# Altium schematic sheet power_POS3V3.schdoc: POS3P3V.schdoc
size A4; Organization: Badgerloop; Address1: 133 Engineering Research; Address2: Building; Address3: Madison, WI 53715; DocumentNumber: 1; Revision: A; SheetNumber: 1; SheetTotal: 2
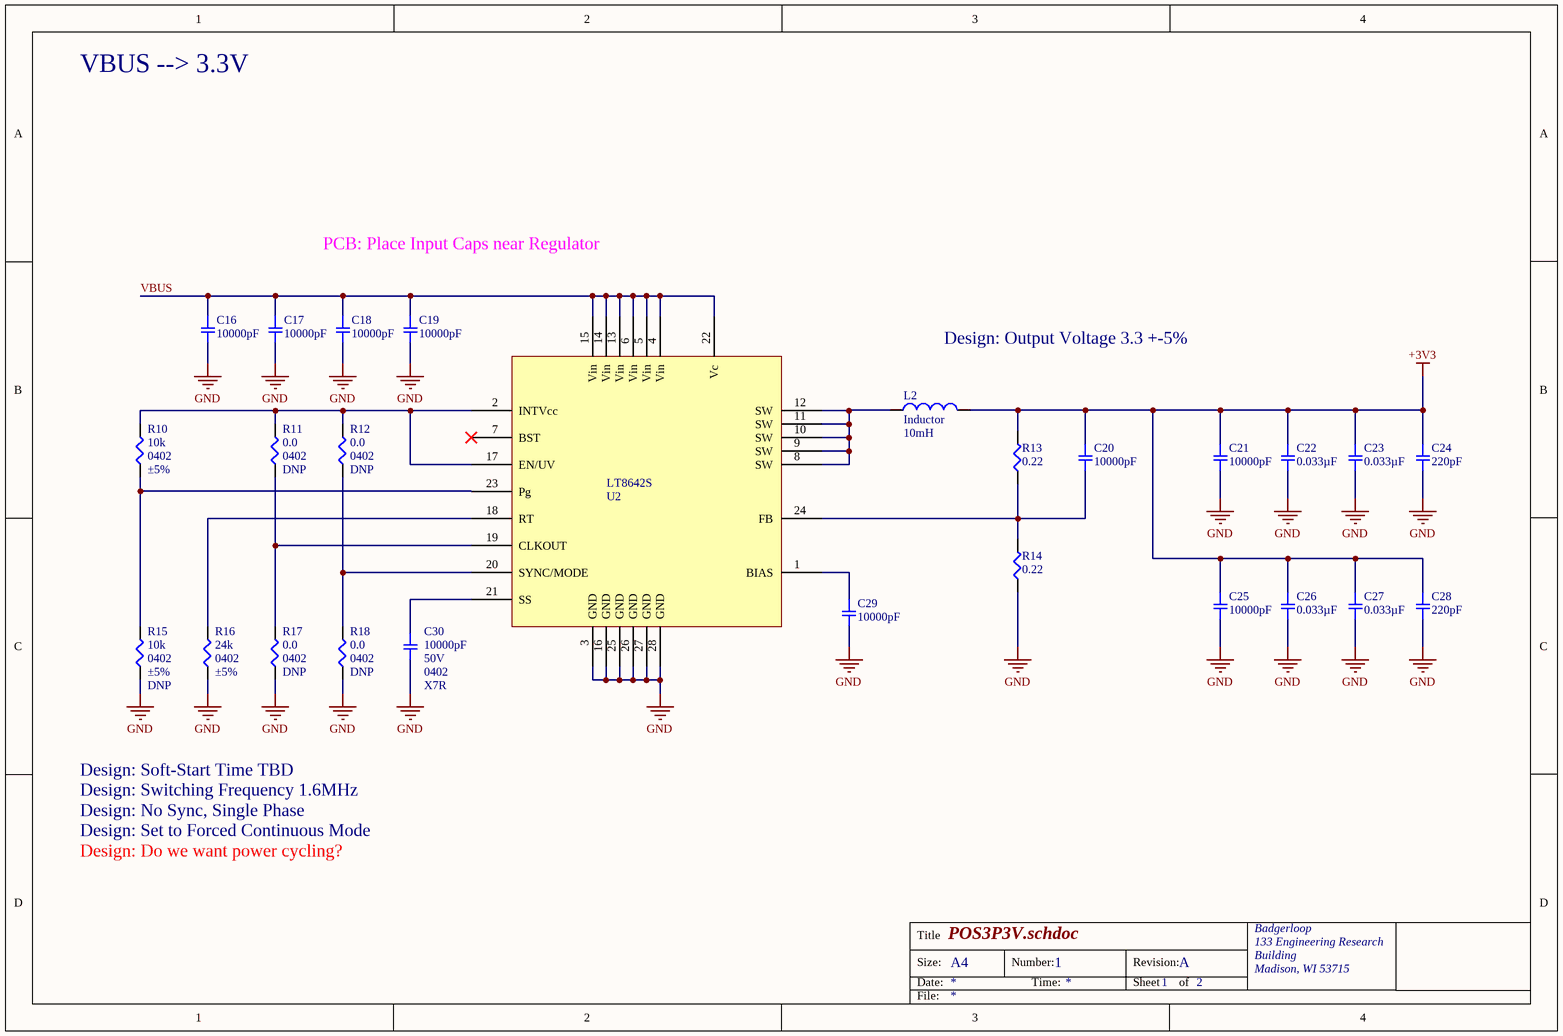
[diagram p0: power_POS3V3.schdoc]

## Parts
C16  10000pF  [SMD-0805C]
C17  10000pF  [SMD-0805C]
C18  10000pF  [SMD-0805C]
C19  10000pF  [SMD-0805C]
C20  10000pF  [SMD-0805C]
C21  10000pF  [SMD-0805C]
C22  0.033µF  [SMD-1206C]
C23  0.033µF  [SMD-1206C]
C24  220pF  [SMD-0402C]
C25  10000pF  [SMD-0805C]
C26  0.033µF  [SMD-1206C]
C27  0.033µF  [SMD-1206C]
C28  220pF  [SMD-0402C]
C29  10000pF  [SMD-0805C]
C30  10000pF  Voltage: 50V  Temperature Coefficient: X7R  Package / Case: 0402  [SMD-0402C]
L2  Inductor  value 10mH  [0402-A]
R10  10k  Tolerance: ±5%  Supplier Device Package: 0402  [SMD-0402-RES]
R11  0.0  Supplier Device Package: 0402  BOM: DNP  [SMD-0402-RES]
R12  0.0  Supplier Device Package: 0402  BOM: DNP  [SMD-0402-RES]
R13  0.22  [SMD-0402-RES]
R14  0.22  [SMD-0402-RES]
R15  10k  Tolerance: ±5%  Supplier Device Package: 0402  BOM_CONFIG: DNP  [SMD-0402-RES]
R16  24k  Tolerance: ±5%  Supplier Device Package: 0402  [SMD-0402-RES]
R17  0.0  Supplier Device Package: 0402  BOM: DNP  [SMD-0402-RES]
R18  0.0  Supplier Device Package: 0402  BOM: DNP  [SMD-0402-RES]
U2  LT8642S

## Nets
+3V3: C20.1 C21.1 C22.1 C23.1 C24.1 C25.1 C26.1 C27.1 C28.1 L2.2 R13.2
GND: C16.2 C17.2 C18.2 C19.2 C21.2 C22.2 C23.2 C24.2 C25.2 C26.2 C27.2 C28.2 C29.2 C30.2 R14.1 R15.1 R16.1 R17.1 R18.1 U2.3(GND) U2.16(GND) U2.25(GND) U2.26(GND) U2.27(GND) U2.28(GND)
VBUS: C16.1 C17.1 C18.1 C19.1 U2.4(Vin) U2.5(Vin) U2.6(Vin) U2.13(Vin) U2.14(Vin) U2.15(Vin) U2.22(Vc)
NetC20_2: C20.2 R13.1 R14.2 U2.24(FB)
NetC29_1: C29.1 U2.1(BIAS)
NetC30_1: C30.1 U2.21(SS)
NetL2_1: L2.1 U2.8(SW) U2.9(SW) U2.10(SW) U2.11(SW) U2.12(SW)
NetR10_1: R10.1 R15.2 U2.23(Pg)
NetR10_2: R10.2 R11.2 R12.2 U2.2(INTVcc) U2.17(EN/UV)
NetR11_1: R11.1 R17.2 U2.19(CLKOUT)
NetR12_1: R12.1 R18.2 U2.20(SYNC/MODE)
NetR16_2: R16.2 U2.18(RT)

Not connected (* = marked no-connect by the designer): U2 7(BST)*

## Notes on the sheet
- VBUS --> 3.3V
- PCB: Place Input Caps near Regulator
- Design: Output Voltage 3.3 +-5%
- Design: Soft-Start Time TBD
- Design: Switching Frequency 1.6MHz
- Design: No Sync, Single Phase
- Design: Set to Forced Continuous Mode
- Design: Do we want power cycling?
- Title
- Size:
- Date:
- A4
- Number:
- Time:
- Revision:
- Sheet
- of
- File:

## Library data of the parts
C16-C21 C25 C29 = GC321AD72E103KX01D: CAP CER 10000PF 250V X7T 0805; Manufacturer: Murata Electronics North America; Factory Stock: 0; Unit Price (USD): 0.3; Minimum Quantity: 1; Tolerance: ±10%; Datasheets: http://search.murata.co.jp/Ceramy/image/img/A01X/G101/ENG/GC321AD72E103KX01-01.pdf; Image: //media.digikey.com/Renders/Murata%20Renders/0805(GC3)200x125.jpg; Digi-Key Part Number: 490-13986-1-ND; Part Number: GC321AD72E103KX01D; Quantity Available: 4000; @ qty: 0; Packaging: Cut Tape (CT); Series: GC3; Part Status: Active; Value: 10000pF; Voltage: 250V; Temperature Coefficient: X7T; Operating Temperature: -55°C ~ 125°C; Features: -; Ratings: AEC-Q200; Applications: Automotive; Mounting Type: Surface Mount, MLCC; Package / Case: 0805 (2012 Metric); Size / Dimension: 0.079" L x 0.049" W (2.00mm x 1.25mm); Height - Seated (Max): -; Thickness (Max): 0.039" (1.00mm); Lead Spacing: -; Lead Style: -
C22 C23 C26 C27 = GC331AD72E333KX01D: CAP CER 0.033UF 250V X7T 1206; Manufacturer: Murata Electronics North America; Factory Stock: 0; Unit Price (USD): 0.33; Minimum Quantity: 1; Tolerance: ±10%; Datasheets: http://search.murata.co.jp/Ceramy/image/img/A01X/G101/ENG/GC331AD72E333KX01-01.pdf; Image: //media.digikey.com/Renders/Murata%20Renders/1206(GC3)320x160.jpg; Digi-Key Part Number: 490-13989-1-ND; Part Number: GC331AD72E333KX01D; Quantity Available: 3999; @ qty: 0; Packaging: Cut Tape (CT); Series: GC3; Part Status: Active; Value: 0.033µF; Voltage: 250V; Temperature Coefficient: X7T; Operating Temperature: -55°C ~ 125°C; Features: -; Ratings: AEC-Q200; Applications: Automotive; Mounting Type: Surface Mount, MLCC; Package / Case: 1206 (3216 Metric); Size / Dimension: 0.126" L x 0.063" W (3.20mm x 1.60mm); Height - Seated (Max): -; Thickness (Max): 0.039" (1.00mm); Lead Spacing: -; Lead Style: -
C24 C28 = GCM1555C1H221JA16D: CAP CER 220PF 50V NP0 0402; Manufacturer: Murata Electronics North America; Factory Stock: 0; Unit Price (USD): 0.1; Minimum Quantity: 1; Tolerance: ±5%; Temperature Coefficient: C0G, NP0; Datasheets: http://www.murata.com/~/media/webrenewal/support/library/catalog/products/capacitor/mlcc/c03e.ashx; Image: //media.digikey.com/Renders/Murata%20Renders/ZRB-SERIES-0402.jpg; Digi-Key Part Number: 490-4927-1-ND; Part Number: GCM1555C1H221JA16D; Quantity Available: 20733; @ qty: 0; Packaging: Cut Tape (CT); Series: GCM; Part Status: Active; Value: 220pF; Voltage: 50V; Operating Temperature: -55°C ~ 125°C; Features: -; Ratings: AEC-Q200; Applications: Automotive; Mounting Type: Surface Mount, MLCC; Package / Case: 0402 (1005 Metric); Size / Dimension: 0.039" L x 0.020" W (1.00mm x 0.50mm); Height - Seated (Max): -; Thickness (Max): 0.022" (0.55mm); Lead Spacing: -; Lead Style: -
C30 = GCM155R71H103KA55D: CAP CER 10000PF 50V X7R 0402; Manufacturer: Murata Electronics North America; Factory Stock: 0; Unit Price (USD): 0.1; Minimum Quantity: 1; Datasheets: http://www.murata.com/~/media/webrenewal/support/library/catalog/products/capacitor/mlcc/c03e.ashx; Image: //media.digikey.com/Renders/Murata%20Renders/ZRB-SERIES-0402.jpg; Digi-Key Part Number: 490-4762-1-ND; Part Number: GCM155R71H103KA55D; Quantity Available: 650067; @ qty: 0; Packaging: Cut Tape (CT); Series: GCM; Part Status: Active; Value: 10000pF; Operating Temperature: -55°C ~ 125°C; Features: -; Ratings: AEC-Q200; Applications: Automotive; Mounting Type: Surface Mount, MLCC; Size / Dimension: 0.039" L x 0.020" W (1.00mm x 0.50mm); Height - Seated (Max): -; Thickness (Max): 0.022" (0.55mm); Lead Spacing: -; Lead Style: -
L2 = Inductor: Code_IEC: 1005; Published: 8-Jun-2000; LatestRevisionDate: 29-May-2009; LatestRevisionNote: IPC-7351 Footprint Added.; PackageReference: 0402-A; Publisher: Altium Limited; PackageDescription: Chip Inductor; Code_JEITA: 0402
R10 R15 = ERJ-2GEJ103X: RES SMD 10K OHM 5% 1/10W 0402; Manufacturer: Panasonic Electronic Components; Factory Stock: 0; Unit Price (USD): 0.00350; @ qty: 1500; Minimum Quantity: 1; Power (Watts): 0.1W, 1/10W; Temperature Coefficient: ±200ppm/°C; Part Number: ERJ-2GEJ103X; Datasheets: http://industrial.panasonic.com/www-cgi/jvcr13pz.cgi?E+PZ+3+AOA0001+ERJ2GEJ103X+7+WW; Image: //media.digikey.com/Photos/Panasonic%20Photos/ERJ-PA2-Series.jpg; Digi-Key Part Number: P10KJCT-ND; Quantity Available: 2560215; Packaging: Cut Tape (CT); Series: ERJ; Part Status: Active; Value: 10k; Composition: Thick Film; Features: Automotive AEC-Q200; Operating Temperature: -55°C ~ 155°C; Package / Case: 0402 (1005 Metric); Size / Dimension: 0.039" L x 0.020" W (1.00mm x 0.50mm); Height - Seated (Max): 0.016" (0.40mm); Number of Terminations: 2; Failure Rate: -
R11 R12 R17 R18 = ERJ-2GE0R00X: RES SMD 0.0OHM JUMPER 1/10W 0402; Manufacturer: Panasonic Electronic Components; Factory Stock: 0; Unit Price (USD): 0.00384; @ qty: 1500; Minimum Quantity: 1; Power (Watts): 0.1W, 1/10W; Part Number: ERJ-2GE0R00X; Datasheets: http://industrial.panasonic.com/www-cgi/jvcr13pz.cgi?E+PZ+3+AOA0001+ERJ2GE0R00X+7+WW; Image: //media.digikey.com/Photos/Panasonic%20Photos/ERJ-PA2-Series.jpg; Digi-Key Part Number: P0.0JCT-ND; Quantity Available: 3152483; Packaging: Cut Tape (CT); Series: ERJ; Part Status: Active; Value: 0.0; Tolerance: Jumper; Composition: Thick Film; Features: Automotive AEC-Q200; Temperature Coefficient: -; Operating Temperature: -55°C ~ 155°C; Package / Case: 0402 (1005 Metric); Size / Dimension: 0.039" L x 0.020" W (1.00mm x 0.50mm); Height - Seated (Max): 0.016" (0.40mm); Number of Terminations: 2; Failure Rate: -
R13 R14 = ERJ-2BQFR22X: RES SMD 0.22 OHM 1% 1/6W 0402; Manufacturer: Panasonic Electronic Components; Factory Stock: 0; Unit Price (USD): 0.10080; @ qty: 1500; Minimum Quantity: 1; Power (Watts): 0.167W, 1/6W; Temperature Coefficient: ±250ppm/°C; Part Number: ERJ-2BQFR22X; Datasheets: https://industrial.panasonic.com/cdbs/www-data/pdf/RDA0000/AOA0000C239.pdf; Image: //media.digikey.com/Photos/Panasonic%20Photos/ERJ-PA2-Series.jpg; Digi-Key Part Number: P.22AKCT-ND; Quantity Available: 14922; Packaging: Cut Tape (CT); Series: ERJ; Part Status: Active; Value: 0.22; Tolerance: ±1%; Composition: Thick Film; Features: Automotive AEC-Q200, Current Sense; Operating Temperature: -55°C ~ 125°C; Package / Case: 0402 (1005 Metric); Supplier Device Package: 0402; Size / Dimension: 0.039" L x 0.020" W (1.00mm x 0.50mm); Height - Seated (Max): 0.016" (0.40mm); Number of Terminations: 2; Failure Rate: -
R16 = ERJ-2GEJ243X: RES SMD 24K OHM 5% 1/10W 0402; Manufacturer: Panasonic Electronic Components; Factory Stock: 0; Unit Price (USD): 0.00350; @ qty: 1500; Minimum Quantity: 1; Power (Watts): 0.1W, 1/10W; Temperature Coefficient: ±200ppm/°C; Part Number: ERJ-2GEJ243X; Datasheets: http://industrial.panasonic.com/www-cgi/jvcr13pz.cgi?E+PZ+3+AOA0001+ERJ2GEJ243X+7+WW; Image: //media.digikey.com/Photos/Panasonic%20Photos/ERJ-PA2-Series.jpg; Digi-Key Part Number: P24KJCT-ND; Quantity Available: 21017; Packaging: Cut Tape (CT); Series: ERJ; Part Status: Active; Value: 24k; Composition: Thick Film; Features: Automotive AEC-Q200; Operating Temperature: -55°C ~ 155°C; Package / Case: 0402 (1005 Metric); Size / Dimension: 0.039" L x 0.020" W (1.00mm x 0.50mm); Height - Seated (Max): 0.016" (0.40mm); Number of Terminations: 2; Failure Rate: -
U2 = LT8642S: 18V, 10A Synchronous / Step-Down Silent Switcher 2